# Altium schematic sheet Sheet1MCU.SchDoc
size A4; SheetNumber: 2; SheetTotal: 2
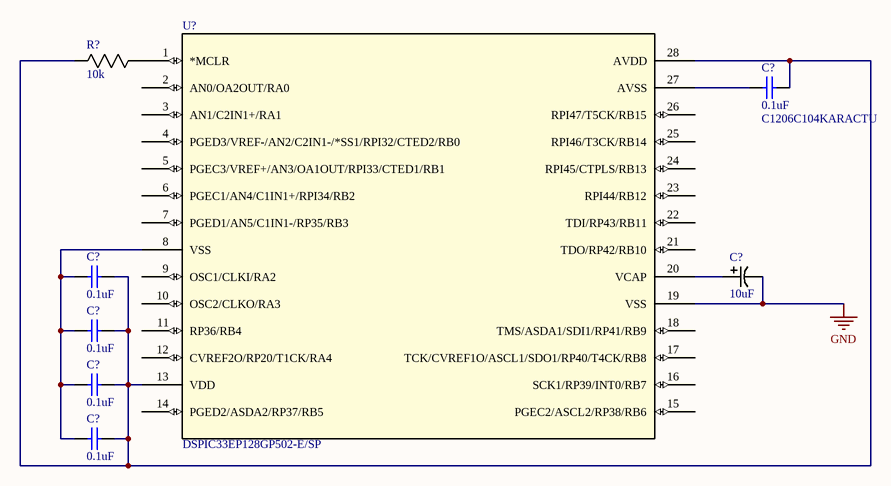
[diagram p0: Sheet1MCU.SchDoc]

## Parts
(Parts that share a designator on the sheet are numbered #1, #2 ... from top to bottom, then left to right.)
C?#1  C1206C104KARACTU  value 0.1uF  [0603]
C?#2  value 0.1uF  [0603]  (hidden comment: C1206C104KARACTU)
C?#3  value 10uF  [TAJA106M010RNJ]  (hidden comment: TAJA106M010RNJ)
C?#4  value 0.1uF  [0603]  (hidden comment: C1206C104KARACTU)
C?#5  value 0.1uF  [0603]  (hidden comment: C1206C104KARACTU)
C?#6  value 0.1uF  [0603]  (hidden comment: C1206C104KARACTU)
R?  value 10k  [0805]  (hidden comment: RES 10K OHM 1% 1/8W 0805)
U?  DSPIC33EP128GP502-E/SP  [DSPIC33EP128GP502]

## Nets
GND: C?#3.2 U?.19(VSS)
NetC?#1_1: C?#1.1 U?.27(AVSS)
NetC?#1_2: C?#1.2 C?#2.2 C?#4.2 C?#5.2 C?#6.2 R?.1 U?.13(VDD) U?.28(AVDD)
NetC?#2_1: C?#2.1 C?#4.1 C?#5.1 C?#6.1 U?.8(VSS)
NetC?#3_1: C?#3.1 U?.20(VCAP)
NetR?_2: R?.2 U?.1(*MCLR)

Not connected (* = marked no-connect by the designer): U? 2(AN0/OA2OUT/RA0) 3(AN1/C2IN1+/RA1) 4(PGED3/VREF-/AN2/C2IN1-/*SS1/RPI32/CTED2/RB0) 5(PGEC3/VREF+/AN3/OA1OUT/RPI33/CTED1/RB1) 6(PGEC1/AN4/C1IN1+/RPI34/RB2) 7(PGED1/AN5/C1IN1-/RP35/RB3) 9(OSC1/CLKI/RA2) 10(OSC2/CLKO/RA3) 11(RP36/RB4) 12(CVREF2O/RP20/T1CK/RA4) 14(PGED2/ASDA2/RP37/RB5) 15(PGEC2/ASCL2/RP38/RB6) 16(SCK1/RP39/INT0/RB7) 17(TCK/CVREF1O/ASCL1/SDO1/RP40/T4CK/RB8) 18(TMS/ASDA1/SDI1/RP41/RB9) 21(TDO/RP42/RB10) 22(TDI/RP43/RB11) 23(RPI44/RB12) 24(RPI45/CTPLS/RB13) 25(RPI46/T3CK/RB14) 26(RPI47/T5CK/RB15)

## Library data of the parts
C?#1 C?#2 C?#4-C?#6 = C1206C104KARACTU: CAP CER 0.1UF 250V X7R 1206
C?#3 = TAJA106M010RNJ: CAP TANT 10UF 20% 10V 1206
R? = RMCF0805FT10K0: 10 kOhms ±1% 0.125W, 1/8W Chip Resistor 0805 (2012 Metric) Automotive AEC-Q200 Thick Film
U? = DSPIC33EP128GP502-E/SP: IC MCU 16BIT 128KB FLASH 28SPDIP